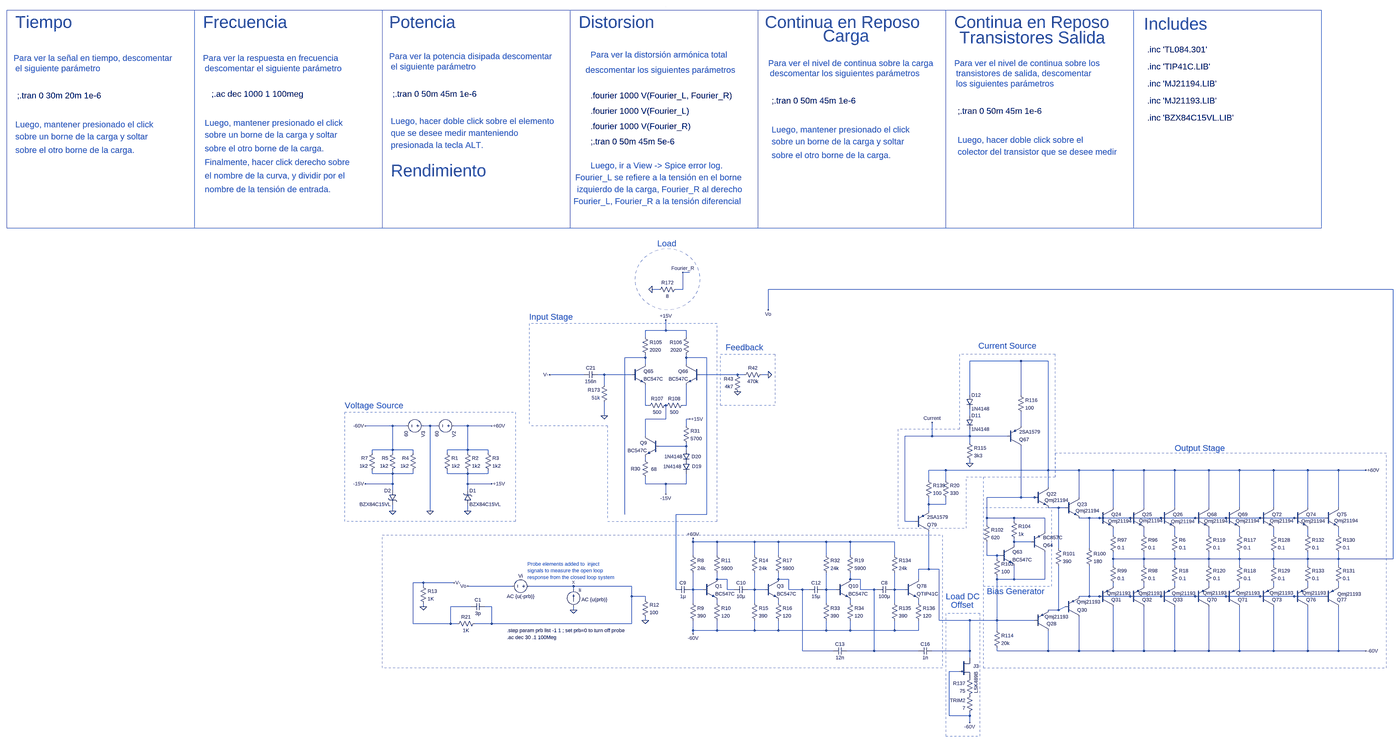
[diagram p0: schematic testV12OL.asc, whole sheet]
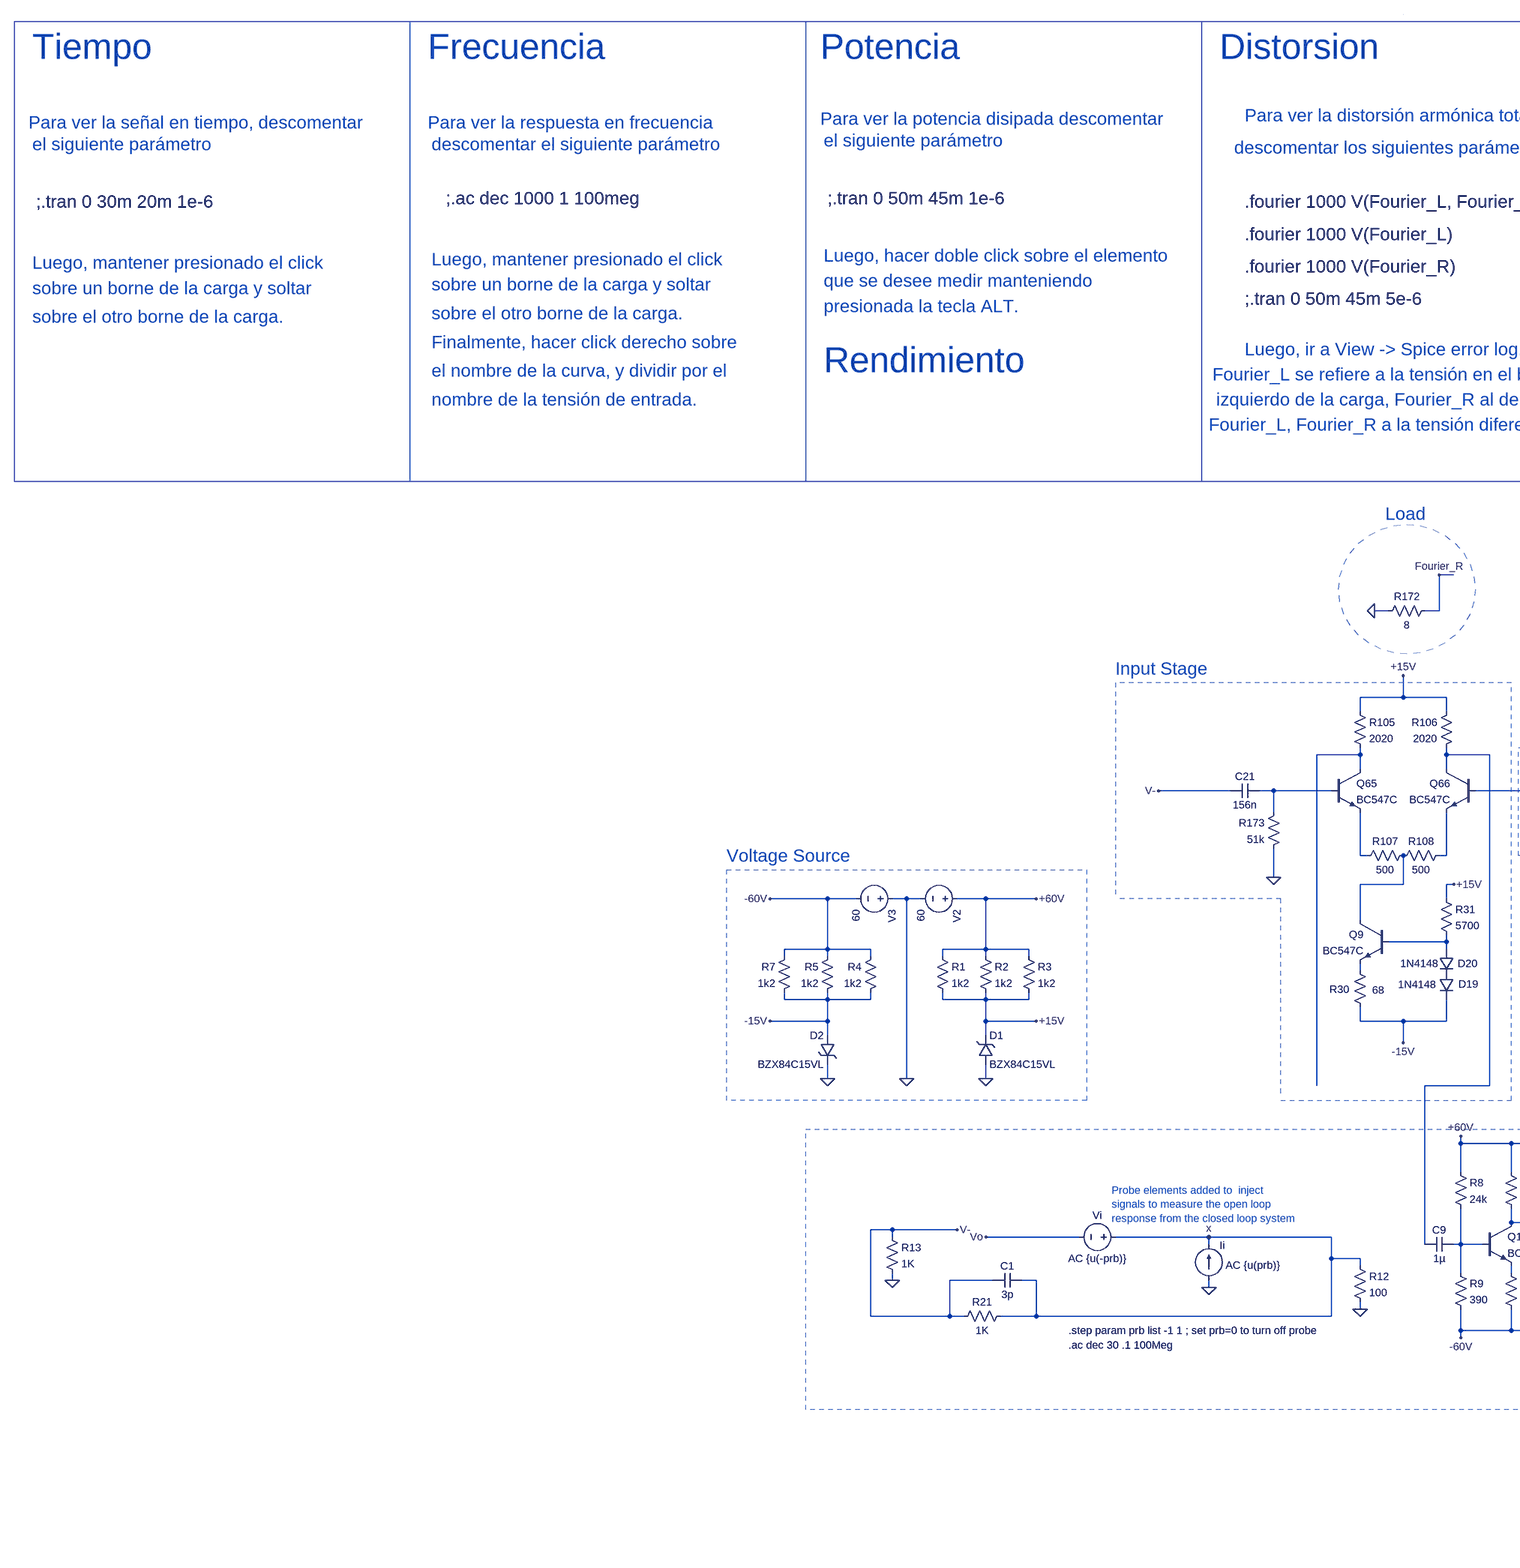
[diagram p1: schematic testV12OL.asc, part, row 1 of 1, column 1 of 2]
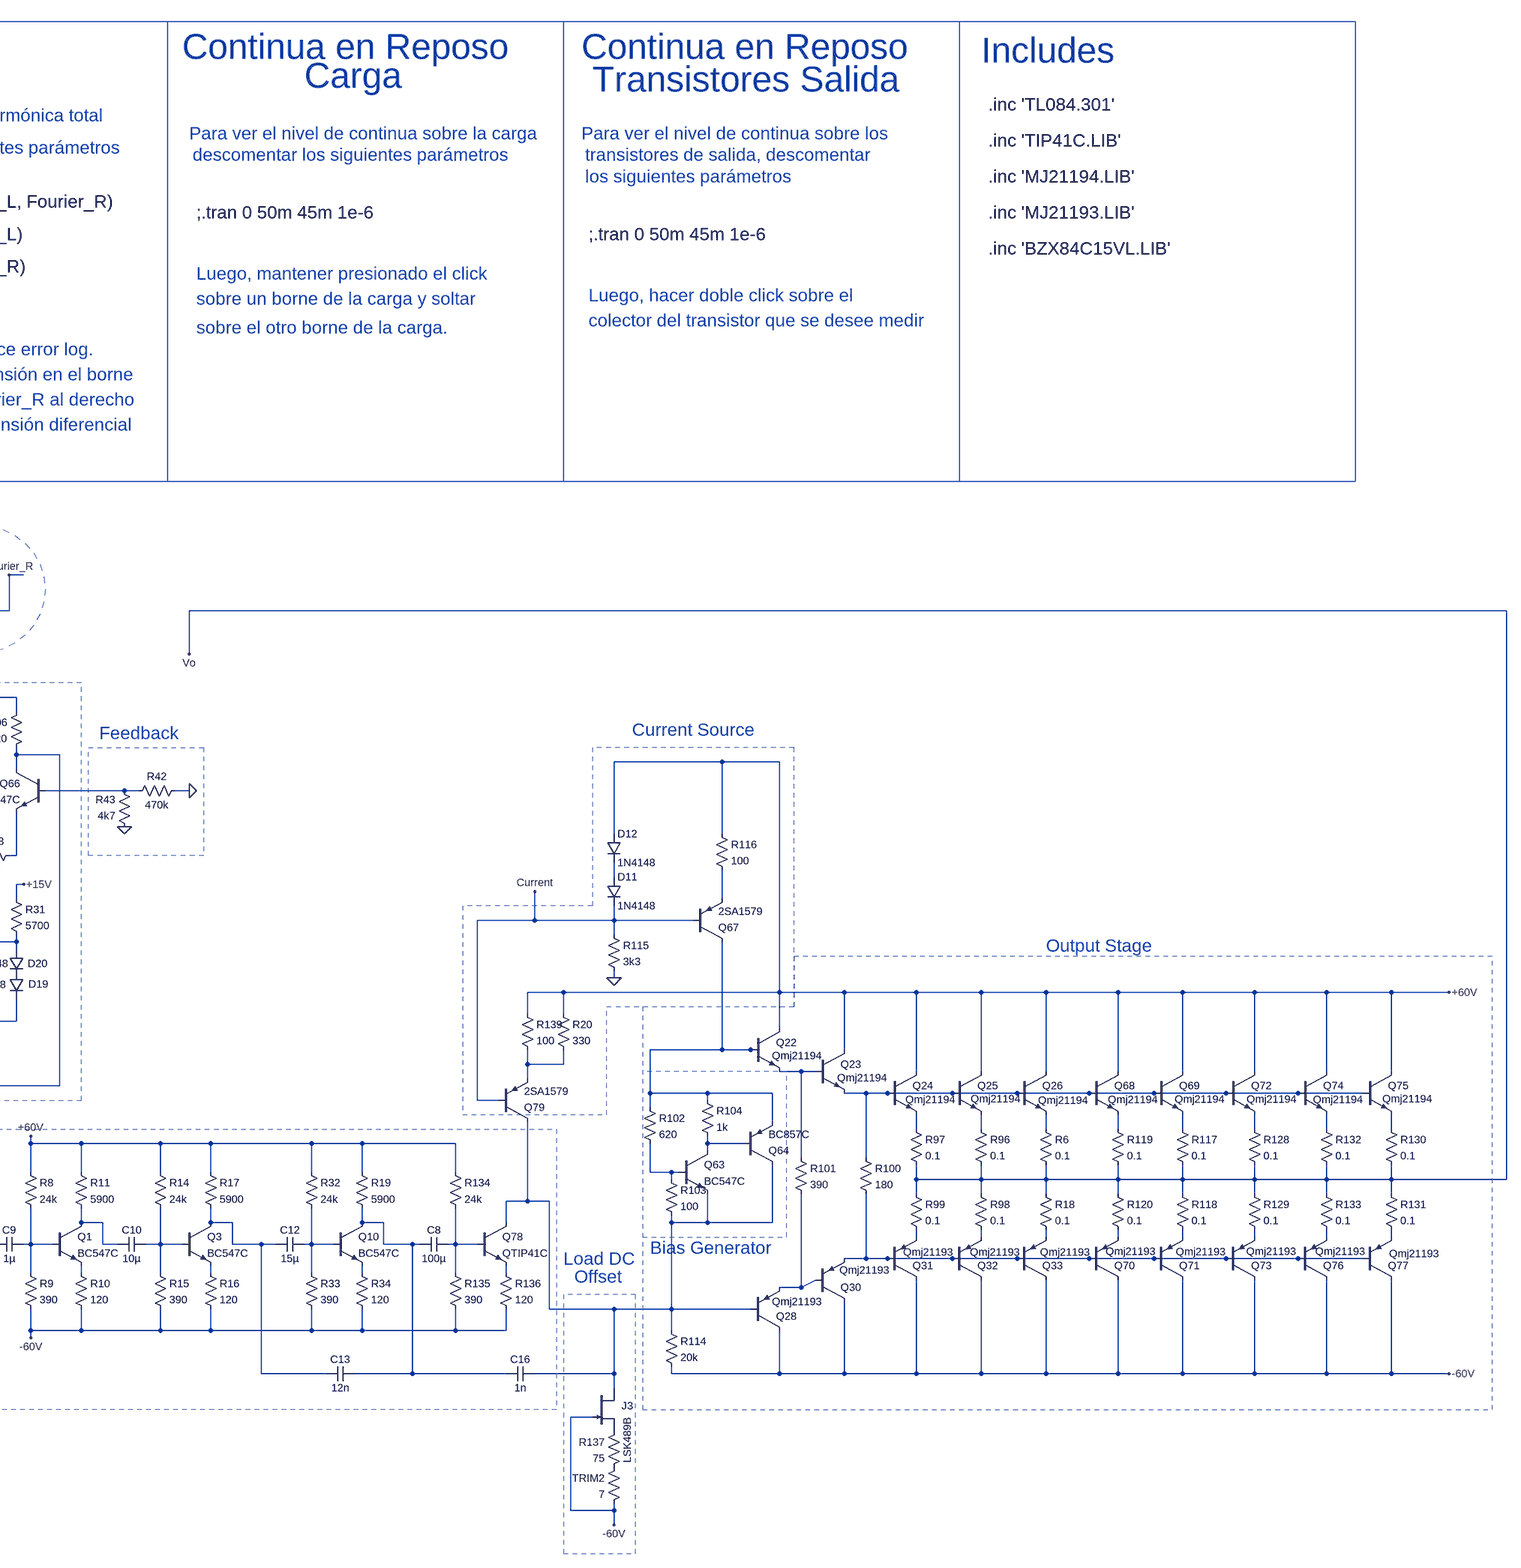
[diagram p2: schematic testV12OL.asc, part, row 1 of 1, column 2 of 2]
testV12OL.asc, the LTspice schematic file:
Version 4
SHEET 1 16980 7664
WIRE 7872 4128 7840 4128
WIRE 7728 4208 7696 4208
WIRE 7840 4208 7840 4128
WIRE 7840 4208 7808 4208
WIRE 11168 4208 8240 4208
WIRE 8240 4304 8240 4208
WIRE 7760 4400 7760 4352
WIRE 7760 4400 7664 4400
WIRE 7856 4400 7760 4400
WIRE 7664 4432 7664 4400
WIRE 7856 4432 7856 4400
WIRE 7664 4528 7664 4512
WIRE 7664 4528 7568 4528
WIRE 7856 4528 7856 4512
WIRE 7952 4528 7856 4528
WIRE 9424 4544 9184 4544
WIRE 9552 4544 9424 4544
WIRE 7664 4560 7664 4528
WIRE 7856 4560 7856 4528
WIRE 7376 4608 7216 4608
WIRE 7472 4608 7440 4608
WIRE 7600 4608 7472 4608
WIRE 8096 4608 7920 4608
WIRE 8128 4608 8096 4608
WIRE 8240 4608 8208 4608
WIRE 7472 4656 7472 4608
WIRE 9184 4704 9184 4544
WIRE 9424 4704 9424 4544
WIRE 7664 4752 7664 4656
WIRE 7680 4752 7664 4752
WIRE 7856 4752 7856 4656
WIRE 7856 4752 7840 4752
WIRE 7472 4800 7472 4736
WIRE 9184 4800 9184 4768
WIRE 7760 4816 7760 4752
WIRE 7760 4816 7664 4816
WIRE 7872 4816 7856 4816
WIRE 6480 4848 6352 4848
WIRE 6544 4848 6480 4848
WIRE 6656 4848 6624 4848
WIRE 6688 4848 6656 4848
WIRE 6832 4848 6768 4848
WIRE 6944 4848 6832 4848
WIRE 7856 4848 7856 4816
WIRE 9424 4848 9424 4784
WIRE 7664 4896 7664 4816
WIRE 9008 4896 9008 4832
WIRE 9008 4896 8880 4896
WIRE 9184 4896 9184 4864
WIRE 9184 4896 9008 4896
WIRE 9360 4896 9184 4896
WIRE 9184 4928 9184 4896
WIRE 7856 4944 7856 4928
WIRE 7856 4944 7728 4944
WIRE 6480 4960 6480 4848
WIRE 6480 4960 6384 4960
WIRE 6576 4960 6480 4960
WIRE 6832 4960 6832 4848
WIRE 6832 4960 6736 4960
WIRE 6928 4960 6832 4960
WIRE 7856 4960 7856 4944
WIRE 6384 4976 6384 4960
WIRE 6480 4976 6480 4960
WIRE 6576 4976 6576 4960
WIRE 6736 4976 6736 4960
WIRE 6832 4976 6832 4960
WIRE 6928 4976 6928 4960
WIRE 7664 5008 7664 4992
WIRE 7856 5024 7856 5008
WIRE 9184 5024 9184 5008
WIRE 9072 5056 8992 5056
WIRE 9552 5056 9552 4544
WIRE 9552 5056 9072 5056
WIRE 9696 5056 9552 5056
WIRE 9856 5056 9696 5056
WIRE 10000 5056 9856 5056
WIRE 10144 5056 10000 5056
WIRE 10304 5056 10144 5056
WIRE 10448 5056 10304 5056
WIRE 10608 5056 10448 5056
WIRE 10768 5056 10608 5056
WIRE 10912 5056 10768 5056
WIRE 11040 5056 10912 5056
WIRE 6384 5072 6384 5056
WIRE 6480 5072 6480 5056
WIRE 6480 5072 6384 5072
WIRE 6576 5072 6576 5056
WIRE 6576 5072 6480 5072
WIRE 6736 5072 6736 5056
WIRE 6832 5072 6832 5056
WIRE 6832 5072 6736 5072
WIRE 6928 5072 6928 5056
WIRE 6928 5072 6832 5072
WIRE 8992 5104 8992 5056
WIRE 9072 5104 9072 5056
WIRE 6480 5120 6480 5072
WIRE 6480 5120 6352 5120
WIRE 6832 5120 6832 5072
WIRE 6944 5120 6832 5120
WIRE 7664 5120 7664 5088
WIRE 7760 5120 7664 5120
WIRE 7856 5120 7856 5072
WIRE 7856 5120 7760 5120
WIRE 9552 5136 9552 5056
WIRE 6480 5152 6480 5120
WIRE 6832 5152 6832 5120
WIRE 7760 5168 7760 5120
WIRE 9424 5184 9424 4944
WIRE 9424 5184 9264 5184
WIRE 9488 5184 9424 5184
WIRE 9504 5184 9488 5184
WIRE 9696 5184 9696 5056
WIRE 8992 5216 8992 5184
WIRE 9072 5216 9072 5184
WIRE 9072 5216 8992 5216
WIRE 9600 5232 9552 5232
WIRE 9632 5232 9600 5232
WIRE 9856 5232 9856 5056
WIRE 10000 5232 10000 5056
WIRE 10144 5232 10144 5056
WIRE 10304 5232 10304 5056
WIRE 10448 5232 10448 5056
WIRE 10608 5232 10608 5056
WIRE 10768 5232 10768 5056
WIRE 10912 5232 10912 5056
WIRE 6480 5248 6480 5216
WIRE 6656 5248 6656 4848
WIRE 6832 5248 6832 5216
WIRE 8992 5248 8992 5216
WIRE 7568 5264 7568 4528
WIRE 7952 5264 7952 4528
WIRE 7952 5264 7808 5264
WIRE 9264 5280 9264 5184
WIRE 9392 5280 9264 5280
WIRE 9536 5280 9392 5280
WIRE 9744 5280 9696 5280
WIRE 9792 5280 9744 5280
WIRE 9936 5280 9792 5280
WIRE 10080 5280 9936 5280
WIRE 10240 5280 10080 5280
WIRE 10384 5280 10240 5280
WIRE 10544 5280 10384 5280
WIRE 10704 5280 10544 5280
WIRE 10848 5280 10704 5280
WIRE 8880 5296 8880 4896
WIRE 8928 5296 8880 5296
WIRE 9392 5296 9392 5280
WIRE 9264 5312 9264 5280
WIRE 9536 5344 9536 5280
WIRE 9856 5360 9856 5328
WIRE 10000 5360 10000 5328
WIRE 10144 5360 10144 5328
WIRE 10304 5360 10304 5328
WIRE 10448 5360 10448 5328
WIRE 10608 5360 10608 5328
WIRE 10768 5360 10768 5328
WIRE 10912 5360 10912 5328
WIRE 7888 5392 7888 5376
WIRE 8000 5392 7888 5392
WIRE 8176 5392 8000 5392
WIRE 8288 5392 8176 5392
WIRE 8512 5392 8288 5392
WIRE 8624 5392 8512 5392
WIRE 8832 5392 8624 5392
WIRE 9392 5392 9392 5376
WIRE 9472 5392 9392 5392
WIRE 9392 5408 9392 5392
WIRE 9600 5424 9600 5232
WIRE 9744 5424 9744 5280
WIRE 7888 5456 7888 5392
WIRE 8000 5456 8000 5392
WIRE 8176 5456 8176 5392
WIRE 8288 5456 8288 5392
WIRE 8512 5456 8512 5392
WIRE 8624 5456 8624 5392
WIRE 8832 5456 8832 5392
WIRE 9264 5456 9264 5392
WIRE 9312 5456 9264 5456
WIRE 9328 5456 9312 5456
WIRE 9312 5472 9312 5456
WIRE 9856 5472 9856 5440
WIRE 10000 5472 10000 5440
WIRE 10000 5472 9856 5472
WIRE 10144 5472 10144 5440
WIRE 10144 5472 10000 5472
WIRE 10304 5472 10304 5440
WIRE 10304 5472 10144 5472
WIRE 10448 5472 10448 5440
WIRE 10448 5472 10304 5472
WIRE 10608 5472 10608 5440
WIRE 10608 5472 10448 5472
WIRE 10768 5472 10768 5440
WIRE 10768 5472 10608 5472
WIRE 10912 5472 10912 5440
WIRE 10912 5472 10768 5472
WIRE 11168 5472 11168 4208
WIRE 11168 5472 10912 5472
WIRE 9856 5504 9856 5472
WIRE 10000 5504 10000 5472
WIRE 10144 5504 10144 5472
WIRE 10304 5504 10304 5472
WIRE 10448 5504 10448 5472
WIRE 10608 5504 10608 5472
WIRE 10768 5504 10768 5472
WIRE 10912 5504 10912 5472
WIRE 8992 5520 8992 5344
WIRE 8992 5520 8944 5520
WIRE 9040 5520 8992 5520
WIRE 8000 5568 8000 5536
WIRE 8048 5568 8000 5568
WIRE 8288 5568 8288 5536
WIRE 8336 5568 8288 5568
WIRE 8624 5568 8624 5536
WIRE 8672 5568 8624 5568
WIRE 8944 5568 8944 5520
WIRE 9312 5568 9312 5552
WIRE 9392 5568 9392 5504
WIRE 9392 5568 9312 5568
WIRE 9536 5568 9536 5440
WIRE 9536 5568 9392 5568
WIRE 6624 5584 6576 5584
WIRE 6768 5584 6624 5584
WIRE 6624 5600 6624 5584
WIRE 7040 5600 6832 5600
WIRE 7328 5600 7120 5600
WIRE 7600 5600 7328 5600
WIRE 9856 5600 9856 5584
WIRE 10000 5600 10000 5584
WIRE 10144 5600 10144 5584
WIRE 10304 5600 10304 5584
WIRE 10448 5600 10448 5584
WIRE 10608 5600 10608 5584
WIRE 10768 5600 10768 5584
WIRE 10912 5600 10912 5584
WIRE 7328 5616 7328 5600
WIRE 7808 5616 7808 5264
WIRE 7888 5616 7888 5536
WIRE 7888 5616 7872 5616
WIRE 7936 5616 7888 5616
WIRE 8048 5616 8048 5568
WIRE 8080 5616 8048 5616
WIRE 8176 5616 8176 5536
WIRE 8176 5616 8144 5616
WIRE 8224 5616 8176 5616
WIRE 8336 5616 8336 5568
WIRE 8400 5616 8336 5616
WIRE 8432 5616 8400 5616
WIRE 8512 5616 8512 5536
WIRE 8512 5616 8496 5616
WIRE 8560 5616 8512 5616
WIRE 8672 5616 8672 5568
WIRE 8736 5616 8672 5616
WIRE 8752 5616 8736 5616
WIRE 8832 5616 8832 5536
WIRE 8832 5616 8816 5616
WIRE 8880 5616 8832 5616
WIRE 7600 5648 7600 5600
WIRE 7664 5648 7600 5648
WIRE 9744 5648 9744 5504
WIRE 9744 5648 9696 5648
WIRE 9792 5648 9744 5648
WIRE 9936 5648 9792 5648
WIRE 10080 5648 9936 5648
WIRE 10240 5648 10080 5648
WIRE 10384 5648 10240 5648
WIRE 10544 5648 10384 5648
WIRE 10704 5648 10544 5648
WIRE 10848 5648 10704 5648
WIRE 7664 5664 7664 5648
WIRE 7888 5680 7888 5616
WIRE 8000 5680 8000 5664
WIRE 8176 5680 8176 5616
WIRE 8288 5680 8288 5664
WIRE 8512 5680 8512 5616
WIRE 8624 5680 8624 5664
WIRE 8832 5680 8832 5616
WIRE 8944 5680 8944 5664
WIRE 6624 5696 6624 5680
WIRE 6848 5696 6752 5696
WIRE 6944 5696 6912 5696
WIRE 7328 5712 7328 5696
WIRE 9600 5712 9600 5504
WIRE 9600 5712 9632 5696
WIRE 9600 5712 9552 5712
WIRE 7664 5760 7664 5744
WIRE 9040 5760 9040 5520
WIRE 9184 5760 9040 5760
WIRE 9312 5760 9312 5568
WIRE 9312 5760 9184 5760
WIRE 9488 5760 9312 5760
WIRE 6576 5776 6576 5584
WIRE 6752 5776 6752 5696
WIRE 6752 5776 6576 5776
WIRE 6784 5776 6752 5776
WIRE 6944 5776 6944 5696
WIRE 6944 5776 6864 5776
WIRE 7600 5776 7600 5648
WIRE 7600 5776 6944 5776
WIRE 7888 5808 7888 5760
WIRE 8000 5808 8000 5760
WIRE 8000 5808 7888 5808
WIRE 8176 5808 8176 5760
WIRE 8176 5808 8000 5808
WIRE 8288 5808 8288 5760
WIRE 8288 5808 8176 5808
WIRE 8512 5808 8512 5760
WIRE 8512 5808 8288 5808
WIRE 8624 5808 8624 5760
WIRE 8624 5808 8512 5808
WIRE 8832 5808 8832 5760
WIRE 8832 5808 8624 5808
WIRE 8944 5808 8944 5760
WIRE 8944 5808 8832 5808
WIRE 9312 5808 9312 5760
WIRE 7888 5824 7888 5808
WIRE 8400 5904 8400 5616
WIRE 8544 5904 8400 5904
WIRE 8736 5904 8736 5616
WIRE 8736 5904 8608 5904
WIRE 8944 5904 8736 5904
WIRE 9184 5904 9184 5760
WIRE 9184 5904 9008 5904
WIRE 9312 5904 9312 5888
WIRE 9552 5904 9552 5808
WIRE 9552 5904 9312 5904
WIRE 9696 5904 9696 5744
WIRE 9696 5904 9552 5904
WIRE 9856 5904 9856 5696
WIRE 9856 5904 9696 5904
WIRE 10000 5904 10000 5696
WIRE 10000 5904 9856 5904
WIRE 10144 5904 10144 5696
WIRE 10144 5904 10000 5904
WIRE 10304 5904 10304 5696
WIRE 10304 5904 10144 5904
WIRE 10448 5904 10448 5696
WIRE 10448 5904 10304 5904
WIRE 10608 5904 10608 5696
WIRE 10608 5904 10448 5904
WIRE 10768 5904 10768 5696
WIRE 10768 5904 10608 5904
WIRE 10912 5904 10912 5696
WIRE 10912 5904 10768 5904
WIRE 11040 5904 10912 5904
WIRE 9184 5936 9184 5904
WIRE 9136 6000 9088 6000
WIRE 9088 6208 9088 6000
WIRE 9184 6208 9184 6192
WIRE 9184 6208 9088 6208
WIRE 9184 6240 9184 6208
FLAG 6656 5248 0
FLAG 6944 4848 +60V
FLAG 6352 4848 -60V
FLAG 7760 4352 +15V
FLAG 9184 5024 0
FLAG 11040 5904 -60V
FLAG 11040 5056 +60V
FLAG 7472 4800 0
FLAG 9184 6240 -60V
FLAG 6832 5248 0
FLAG 6480 5248 0
FLAG 6944 5120 +15V
FLAG 6352 5120 -15V
FLAG 7840 4128 Fourier_R
FLAG 7760 5168 -15V
FLAG 7872 4816 +15V
FLAG 7888 5376 +60V
FLAG 7888 5824 -60V
FLAG 8096 4688 0
FLAG 9008 4832 Current
FLAG 7696 4208 0
FLAG 6624 5696 0
FLAG 7664 5760 0
FLAG 7328 5712 0
FLAG 7328 5600 x
FLAG 6768 5584 V-
FLAG 7216 4608 V-
FLAG 8240 4304 Vo
FLAG 6832 5600 Vo
FLAG 8240 4608 0
DATAFLAG 7280 4608 ""
DATAFLAG 7280 4608 ""
SYMBOL voltage 6784 4848 R90
WINDOW 123 0 0 Left 0
WINDOW 39 24 44 Left 2
SYMATTR InstName V2
SYMATTR Value 60
SYMBOL voltage 6640 4848 R90
WINDOW 123 0 0 Left 0
WINDOW 39 24 124 Left 2
SYMATTR InstName V3
SYMATTR Value 60
SYMBOL npn 9488 5136 R0
WINDOW 3 47 61 Left 2
SYMATTR Value Qmj21194
SYMATTR InstName Q22
SYMBOL npn 9632 5184 R0
WINDOW 3 48 62 Left 2
SYMATTR Value Qmj21194
SYMATTR InstName Q23
SYMBOL npn 9792 5232 R0
WINDOW 3 40 63 Left 2
SYMATTR Value Qmj21194
SYMATTR InstName Q24
SYMBOL npn 9936 5232 R0
WINDOW 3 41 61 Left 2
SYMATTR Value Qmj21194
SYMATTR InstName Q25
SYMBOL npn 10080 5232 R0
WINDOW 3 47 64 Left 2
SYMATTR Value Qmj21194
SYMATTR InstName Q26
SYMBOL pnp 9488 5808 M180
WINDOW 3 47 64 Left 2
SYMATTR Value Qmj21193
SYMATTR InstName Q28
SYMBOL pnp 9632 5744 M180
WINDOW 3 53 70 Left 2
SYMATTR Value Qmj21193
SYMATTR InstName Q30
SYMBOL pnp 9792 5696 M180
WINDOW 3 35 62 Left 2
SYMATTR Value Qmj21193
SYMATTR InstName Q31
SYMBOL pnp 9936 5696 M180
WINDOW 3 39 62 Left 2
SYMATTR Value Qmj21193
SYMATTR InstName Q32
SYMBOL pnp 10080 5696 M180
WINDOW 3 51 62 Left 2
SYMATTR Value Qmj21193
SYMATTR InstName Q33
SYMBOL res 10128 5344 R0
SYMATTR InstName R6
SYMATTR Value 0.1
SYMBOL res 10128 5488 R0
SYMATTR InstName R18
SYMATTR Value 0.1
SYMBOL res 9984 5344 R0
SYMATTR InstName R96
SYMATTR Value 0.1
SYMBOL res 9840 5344 R0
SYMATTR InstName R97
SYMATTR Value 0.1
SYMBOL res 9984 5488 R0
SYMATTR InstName R98
SYMATTR Value 0.1
SYMBOL res 9840 5488 R0
SYMATTR InstName R99
SYMATTR Value 0.1
SYMBOL res 9728 5408 R0
SYMATTR InstName R100
SYMATTR Value 180
SYMBOL res 9584 5408 R0
SYMATTR InstName R101
SYMATTR Value 390
SYMBOL npn 9328 5408 R0
SYMATTR InstName Q63
SYMATTR Value BC547C
SYMBOL res 9248 5296 R0
SYMATTR InstName R102
SYMATTR Value 620
SYMBOL res 9296 5456 R0
SYMATTR InstName R103
SYMATTR Value 100
SYMBOL res 9376 5280 R0
SYMATTR InstName R104
SYMATTR Value 1k
SYMBOL pnp 9472 5440 M180
SYMATTR InstName Q64
SYMATTR Value BC857C
SYMBOL npn 7600 4560 R0
SYMATTR InstName Q65
SYMATTR Value BC547C
SYMBOL npn 7920 4560 M0
SYMATTR InstName Q66
SYMATTR Value BC547C
SYMBOL res 7648 4416 R0
SYMATTR InstName R105
SYMATTR Value 2020
SYMBOL res 7872 4416 M0
SYMATTR InstName R106
SYMATTR Value 2020
SYMBOL res 7776 4736 R90
WINDOW 0 0 56 VBottom 2
WINDOW 3 32 56 VTop 2
SYMATTR InstName R107
SYMATTR Value 500
SYMBOL res 7856 4736 R90
WINDOW 0 0 56 VBottom 2
WINDOW 3 32 56 VTop 2
SYMATTR InstName R108
SYMATTR Value 500
SYMBOL res 9296 5792 R0
SYMATTR InstName R114
SYMATTR Value 20k
SYMBOL pnp 9360 4944 M180
SYMATTR InstName Q67
SYMATTR Value 2SA1579
SYMBOL res 9168 4912 R0
SYMATTR InstName R115
SYMATTR Value 3k3
SYMBOL diode 9168 4800 R0
SYMATTR InstName D11
SYMATTR Value 1N4148
SYMBOL diode 9168 4704 R0
SYMATTR InstName D12
SYMATTR Value 1N4148
SYMBOL res 9408 4688 R0
SYMATTR InstName R116
SYMATTR Value 100
SYMBOL npn 10240 5232 R0
WINDOW 3 42 63 Left 2
SYMATTR Value Qmj21194
SYMATTR InstName Q68
SYMBOL npn 10384 5232 R0
WINDOW 3 46 62 Left 2
SYMATTR Value Qmj21194
SYMATTR InstName Q69
SYMBOL pnp 10240 5696 M180
WINDOW 3 37 64 Left 2
SYMATTR Value Qmj21193
SYMATTR InstName Q70
SYMBOL pnp 10384 5696 M180
WINDOW 3 49 63 Left 2
SYMATTR Value Qmj21193
SYMATTR InstName Q71
SYMBOL res 10432 5344 R0
SYMATTR InstName R117
SYMATTR Value 0.1
SYMBOL res 10432 5488 R0
SYMATTR InstName R118
SYMATTR Value 0.1
SYMBOL res 10288 5344 R0
SYMATTR InstName R119
SYMATTR Value 0.1
SYMBOL res 10288 5488 R0
SYMATTR InstName R120
SYMATTR Value 0.1
SYMBOL npn 10544 5232 R0
WINDOW 3 46 62 Left 2
SYMATTR Value Qmj21194
SYMATTR InstName Q72
SYMBOL pnp 10544 5696 M180
WINDOW 3 45 64 Left 2
SYMATTR Value Qmj21193
SYMATTR InstName Q73
SYMBOL res 10592 5344 R0
SYMATTR InstName R128
SYMATTR Value 0.1
SYMBOL res 10592 5488 R0
SYMATTR InstName R129
SYMATTR Value 0.1
SYMBOL npn 10704 5232 R0
WINDOW 3 34 63 Left 2
SYMATTR Value Qmj21194
SYMATTR InstName Q74
SYMBOL npn 10848 5232 R0
WINDOW 3 44 61 Left 2
SYMATTR Value Qmj21194
SYMATTR InstName Q75
SYMBOL pnp 10704 5696 M180
WINDOW 3 39 64 Left 2
SYMATTR Value Qmj21193
SYMATTR InstName Q76
SYMBOL pnp 10848 5696 M180
WINDOW 3 59 59 Left 2
SYMATTR Value Qmj21193
SYMATTR InstName Q77
SYMBOL res 10896 5344 R0
SYMATTR InstName R130
SYMATTR Value 0.1
SYMBOL res 10896 5488 R0
SYMATTR InstName R131
SYMATTR Value 0.1
SYMBOL res 10752 5344 R0
SYMATTR InstName R132
SYMATTR Value 0.1
SYMBOL res 10752 5488 R0
SYMATTR InstName R133
SYMATTR Value 0.1
SYMBOL res 8816 5440 R0
SYMATTR InstName R134
SYMATTR Value 24k
SYMBOL res 8816 5664 R0
SYMATTR InstName R135
SYMATTR Value 390
SYMBOL npn 8880 5568 R0
SYMATTR InstName Q78
SYMATTR Value QTIP41C
SYMBOL res 8928 5664 R0
SYMATTR InstName R136
SYMATTR Value 120
SYMBOL njf 9136 5936 R0
WINDOW 0 65 39 Left 2
WINDOW 3 78 65 VRight 2
SYMATTR InstName J3
SYMATTR Value LSK489B
SYMBOL res 9200 6016 M0
SYMATTR InstName R137
SYMATTR Value 75
SYMBOL pnp 8928 5344 M180
SYMATTR InstName Q79
SYMATTR Value 2SA1579
SYMBOL res 8976 5088 R0
SYMATTR InstName R139
SYMATTR Value 100
SYMBOL cap 9008 5888 R90
WINDOW 0 0 32 VBottom 2
WINDOW 3 32 32 VTop 2
SYMATTR InstName C16
SYMATTR Value 1n
SYMATTR SpiceLine Rser=0.1
SYMBOL cap 7440 4592 R90
WINDOW 0 0 32 VBottom 2
WINDOW 3 32 32 VTop 2
SYMATTR InstName C21
SYMATTR Value 156n
SYMATTR SpiceLine Rser=0.1
SYMBOL res 7488 4640 M0
SYMATTR InstName R173
SYMATTR Value 51k
SYMBOL res 7824 4192 R90
WINDOW 0 0 56 VBottom 2
WINDOW 3 32 56 VTop 2
SYMATTR InstName R172
SYMATTR Value 8
SYMBOL res 6720 4960 R0
SYMATTR InstName R1
SYMATTR Value 1k2
SYMBOL res 6816 4960 R0
SYMATTR InstName R2
SYMATTR Value 1k2
SYMBOL res 6912 4960 R0
SYMATTR InstName R3
SYMATTR Value 1k2
SYMBOL res 6592 4960 M0
SYMATTR InstName R4
SYMATTR Value 1k2
SYMBOL res 6496 4960 M0
SYMATTR InstName R5
SYMATTR Value 1k2
SYMBOL res 6400 4960 M0
SYMATTR InstName R7
SYMATTR Value 1k2
SYMBOL zener 6816 5216 M180
WINDOW 0 24 64 Left 2
WINDOW 3 24 0 Left 2
SYMATTR InstName D1
SYMATTR Value BZX84C15VL
SYMBOL zener 6496 5152 M0
SYMATTR InstName D2
SYMATTR Value BZX84C15VL
SYMBOL diode 7872 5008 M0
WINDOW 0 -55 30 Left 2
WINDOW 3 39 31 Left 2
SYMATTR InstName D19
SYMATTR Value 1N4148
SYMBOL diode 7872 4960 M0
WINDOW 0 -53 32 Left 2
WINDOW 3 34 32 Left 2
SYMATTR InstName D20
SYMATTR Value 1N4148
SYMBOL npn 7728 4896 M0
SYMATTR InstName Q9
SYMATTR Value BC547C
SYMBOL res 7648 4992 R0
WINDOW 0 -52 58 Left 2
WINDOW 3 43 59 Left 2
SYMATTR InstName R30
SYMATTR Value 68
SYMBOL res 7840 4832 R0
SYMATTR InstName R31
SYMATTR Value 5700
SYMBOL res 7872 5440 R0
SYMATTR InstName R8
SYMATTR Value 24k
SYMBOL res 7872 5664 R0
SYMATTR InstName R9
SYMATTR Value 390
SYMBOL npn 7936 5568 R0
SYMATTR InstName Q1
SYMATTR Value BC547C
SYMBOL res 7984 5664 R0
SYMATTR InstName R10
SYMATTR Value 120
SYMBOL res 8160 5440 R0
SYMATTR InstName R14
SYMATTR Value 24k
SYMBOL res 8160 5664 R0
SYMATTR InstName R15
SYMATTR Value 390
SYMBOL npn 8224 5568 R0
SYMATTR InstName Q3
SYMATTR Value BC547C
SYMBOL res 8272 5664 R0
SYMATTR InstName R16
SYMATTR Value 120
SYMBOL res 8496 5440 R0
SYMATTR InstName R32
SYMATTR Value 24k
SYMBOL res 8496 5664 R0
SYMATTR InstName R33
SYMATTR Value 390
SYMBOL npn 8560 5568 R0
SYMATTR InstName Q10
SYMATTR Value BC547C
SYMBOL res 8608 5664 R0
SYMATTR InstName R34
SYMATTR Value 120
SYMBOL res 8224 4592 R90
WINDOW 0 0 56 VBottom 2
WINDOW 3 32 56 VTop 2
SYMATTR InstName R42
SYMATTR Value 470k
SYMBOL res 8112 4704 R180
WINDOW 0 36 76 Left 2
WINDOW 3 36 40 Left 2
SYMATTR InstName R43
SYMATTR Value 4k7
SYMBOL res 7984 5440 R0
SYMATTR InstName R11
SYMATTR Value 5900
SYMBOL res 8272 5440 R0
SYMATTR InstName R17
SYMATTR Value 5900
SYMBOL res 8608 5440 R0
SYMATTR InstName R19
SYMATTR Value 5900
SYMBOL cap 8544 5888 M90
WINDOW 0 0 32 VBottom 2
WINDOW 3 32 32 VTop 2
SYMATTR InstName C13
SYMATTR Value 12n
SYMATTR SpiceLine Rser=0.1
SYMBOL cap 8752 5600 M90
WINDOW 0 0 32 VBottom 2
WINDOW 3 32 32 VTop 2
SYMATTR InstName C8
SYMATTR Value 100µ
SYMATTR SpiceLine Rser=0.1
SYMBOL cap 7872 5600 R90
WINDOW 0 0 32 VBottom 2
WINDOW 3 32 32 VTop 2
SYMATTR InstName C9
SYMATTR Value 1µ
SYMBOL cap 8144 5600 R90
WINDOW 0 0 32 VBottom 2
WINDOW 3 32 32 VTop 2
SYMATTR InstName C10
SYMATTR Value 10µ
SYMBOL cap 8496 5600 R90
WINDOW 0 0 32 VBottom 2
WINDOW 3 32 32 VTop 2
SYMATTR InstName C12
SYMATTR Value 15µ
SYMBOL res 9056 5088 R0
SYMATTR InstName R20
SYMATTR Value 330
SYMBOL res 9200 6096 M0
SYMATTR InstName TRIM2
SYMATTR Value 7
SYMBOL res 7648 5648 R0
SYMATTR InstName R12
SYMATTR Value 100
SYMBOL res 6608 5584 R0
SYMATTR InstName R13
SYMATTR Value 1K
SYMBOL res 6880 5760 R90
WINDOW 0 0 56 VBottom 2
WINDOW 3 32 56 VTop 2
SYMATTR InstName R21
SYMATTR Value 1K
SYMBOL cap 6912 5680 R90
WINDOW 0 0 32 VBottom 2
WINDOW 3 32 32 VTop 2
SYMATTR InstName C1
SYMATTR Value 3p
SYMBOL current 7328 5696 M180
WINDOW 0 24 77 Left 2
WINDOW 3 24 0 Left 2
WINDOW 123 37 33 Left 2
WINDOW 39 0 0 Left 2
SYMATTR InstName Ii
SYMATTR Value ""
SYMATTR Value2 AC {u(prb)}
SYMBOL voltage 7136 5600 M270
WINDOW 0 32 56 VTop 2
WINDOW 3 -32 56 VBottom 2
WINDOW 123 -32 56 VBottom 2
WINDOW 39 -32 56 VBottom 2
SYMATTR InstName Vi
SYMATTR Value ""
SYMATTR Value2 AC {u(-prb)}
TEXT 10016 2552 Left 4 !.inc 'TL084.301'
TEXT 10016 2632 Left 4 !.inc 'TIP41C.LIB'
TEXT 10016 2712 Left 4 !.inc 'MJ21194.LIB'
TEXT 10016 2792 Left 4 !.inc 'MJ21193.LIB'
TEXT 10016 2872 Left 4 !.inc 'BZX84C15VL.LIB'
TEXT 6480 2760 Left 4 !;.tran 0 50m 45m 1e-6
TEXT 5632 2760 Left 4 !;.ac dec 1000 1 100meg
TEXT 7408 2768 Left 4 !.fourier 1000 V(Fourier_L, Fourier_R)
TEXT 7408 2840 Left 4 !.fourier 1000 V(Fourier_L)
TEXT 7408 2912 Left 4 !.fourier 1000 V(Fourier_R)
TEXT 6256 4752 Left 4 ;Voltage Source
TEXT 7120 4336 Left 4 ;Input Stage
TEXT 8040 4480 Left 4 ;Feedback
TEXT 10144 4952 Left 4 ;Output Stage
TEXT 7720 3992 Left 4 ;Load
TEXT 9072 5648 Left 4 ;Load DC
TEXT 9224 4472 Left 4 ;Current Source
TEXT 9264 5624 Left 4 ;Bias Generator
TEXT 4696 2424 Left 6 ;Tiempo
TEXT 9096 5688 Left 4 ;Offset
TEXT 5592 2424 Left 6 ;Frecuencia
TEXT 6464 2424 Left 6 ;Potencia
TEXT 7352 2424 Left 6 ;Distorsion
TEXT 8224 2424 Left 6 ;Continua en Reposo
TEXT 10000 2432 Left 6 ;Includes
TEXT 9112 2424 Left 6 ;Continua en Reposo
TEXT 8496 2488 Left 6 ;Carga
TEXT 9136 2496 Left 6 ;Transistores Salida
TEXT 7408 2576 Left 4 ;Para ver la distorsión armónica total
TEXT 7384 2648 Left 4 ;descomentar los siguientes parámetros
TEXT 7408 3096 Left 4 ;Luego, ir a View -> Spice error log.
TEXT 7336 3152 Left 4 ;Fourier_L se refiere a la tensión en el borne
TEXT 7344 3208 Left 4 ;izquierdo de la carga, Fourier_R al derecho
TEXT 7328 3264 Left 4 ;Fourier_L, Fourier_R a la tensión diferencial
TEXT 6464 2584 Left 4 ;Para ver la potencia disipada descomentar
TEXT 6472 2632 Left 4 ;el siguiente parámetro
TEXT 7408 2984 Left 4 !;.tran 0 50m 45m 5e-6
TEXT 6472 2888 Left 4 ;Luego, hacer doble click sobre el elemento
TEXT 6472 2944 Left 4 ;que se desee medir manteniendo
TEXT 5592 2592 Left 4 ;Para ver la respuesta en frecuencia
TEXT 5600 2640 Left 4 ;descomentar el siguiente parámetro
TEXT 5600 2896 Left 4 ;Luego, mantener presionado el click
TEXT 5600 2952 Left 4 ;sobre un borne de la carga y soltar
TEXT 5600 3016 Left 4 ;sobre el otro borne de la carga.
TEXT 5600 3080 Left 4 ;Finalmente, hacer click derecho sobre
TEXT 5600 3144 Left 4 ;el nombre de la curva, y dividir por el
TEXT 5600 3208 Left 4 ;nombre de la tensión de entrada.
TEXT 8256 2792 Left 4 !;.tran 0 50m 45m 1e-6
TEXT 8240 2616 Left 4 ;Para ver el nivel de continua sobre la carga
TEXT 8248 2664 Left 4 ;descomentar los siguientes parámetros
TEXT 8256 2928 Left 4 ;Luego, mantener presionado el click
TEXT 8256 2984 Left 4 ;sobre un borne de la carga y soltar
TEXT 8256 3048 Left 4 ;sobre el otro borne de la carga.
TEXT 9128 2840 Left 4 !;.tran 0 50m 45m 1e-6
TEXT 9112 2616 Left 4 ;Para ver el nivel de continua sobre los
TEXT 9120 2664 Left 4 ;transistores de salida, descomentar
TEXT 9128 2976 Left 4 ;Luego, hacer doble click sobre el
TEXT 9128 3032 Left 4 ;colector del transistor que se desee medir
TEXT 9120 2712 Left 4 ;los siguientes parámetros
TEXT 4704 2768 Left 4 !;.tran 0 30m 20m 1e-6
TEXT 4688 2592 Left 4 ;Para ver la señal en tiempo, descomentar
TEXT 4696 2640 Left 4 ;el siguiente parámetro
TEXT 4696 2904 Left 4 ;Luego, mantener presionado el click
TEXT 4696 2960 Left 4 ;sobre un borne de la carga y soltar
TEXT 4696 3024 Left 4 ;sobre el otro borne de la carga.
TEXT 6472 3120 Left 6 ;Rendimiento
TEXT 6472 3000 Left 4 ;presionada la tecla ALT.
TEXT 7016 5840 Left 2 !.ac dec 30 .1 100Meg
TEXT 7016 5808 Left 2 !.step param prb list -1 1 ; set prb=0 to turn off probe
TEXT 7112 5496 Left 2 ;Probe elements added to  inject\nsignals to measure the open loop\nresponse from the closed loop system
LINE Normal 7488 4848 7120 4848 2
LINE Normal 7488 5280 7488 4848 2
LINE Normal 7120 4368 7120 4848 2
LINE Normal 8000 4368 7120 4368 2
LINE Normal 8000 5296 8000 4368 2
LINE Normal 7488 5296 8000 5296 2
LINE Normal 8016 4752 8016 4512 2
LINE Normal 8272 4752 8016 4752 2
LINE Normal 8272 4512 8272 4752 2
LINE Normal 8016 4512 8272 4512 2
LINE Normal 11136 5984 11136 4976 2
LINE Normal 9248 5984 11136 5984 2
LINE Normal 8272 4752 8016 4752 2
LINE Normal 9584 4976 9584 5088 2
LINE Normal 11136 4976 9584 4976 2
LINE Normal 11136 5984 11136 4976 2
LINE Normal 9248 5984 11136 5984 2
LINE Normal 9248 5088 9248 5984 2
LINE Normal 8848 4864 8848 5328 2
LINE Normal 9136 4864 8848 4864 2
LINE Normal 9136 4512 9136 4864 2
LINE Normal 9584 4512 9136 4512 2
LINE Normal 9584 5088 9584 4512 2
LINE Normal 9168 5088 9584 5088 2
LINE Normal 9168 5328 9168 5088 2
LINE Normal 8848 5328 9168 5328 2
LINE Normal 9568 5232 9248 5232 2
LINE Normal 9568 5600 9568 5232 2
LINE Normal 9248 5600 9568 5600 2
LINE Normal 7808 2368 7808 2368 2
LINE Normal 5552 3120 5552 3184
LINE Normal 6432 3120 6432 3184
LINE Normal 7760 2352 7760 2352
LINE Normal 5552 2368 5552 3920
LINE Normal 6432 2368 6432 3920
LINE Normal 7312 2368 7312 3920
LINE Normal 8192 2368 8192 3920
LINE Normal 9072 2368 9072 3920
LINE Normal 9952 2368 9952 3920
RECTANGLE Normal 7056 5296 6256 4784 2
RECTANGLE Normal 9056 5984 6432 5360 2
RECTANGLE Normal 9232 5728 9072 6304 2
RECTANGLE Normal 10832 3920 4656 2368
CIRCLE Normal 7920 4304 7616 4016 2

The netlist it stands for:
* testV12OL.asc
V2 +60V 0 60
V3 0 -60V 60
Q22 +60V N013 N015 0 Qmj21194
Q23 +60V N015 N016 0 Qmj21194
Q24 +60V N016 N017 0 Qmj21194
Q25 +60V N016 N018 0 Qmj21194
Q26 +60V N016 N019 0 Qmj21194
Q28 -60V N027 N048 0 Qmj21193
Q30 -60V N048 N043 0 Qmj21193
Q31 -60V N043 N031 0 Qmj21193
Q32 -60V N043 N032 0 Qmj21193
Q33 -60V N043 N033 0 Qmj21193
R6 N019 Vo 0.1
R18 Vo N033 0.1
R96 N018 Vo 0.1
R97 N017 Vo 0.1
R98 Vo N032 0.1
R99 Vo N031 0.1
R100 N016 N043 180
R101 N015 N048 390
Q63 N025 N026 N027 0 BC547C
R102 N013 N026 620
R103 N026 N027 100
R104 N013 N025 1k
Q64 N027 N025 N013 0 BC857C
Q65 N001 N003 N005 0 BC547C
Q66 N002 N004 N006 0 BC547C
R105 +15V N001 2020
R106 +15V N002 2020
R107 N008 N005 500
R108 N006 N008 500
R114 N027 -60V 20k
Q67 N013 Current N009 0 2SA1579
R115 Current 0 3k3
D11 N007 Current 1N4148
D12 +60V N007 1N4148
R116 +60V N009 100
Q68 +60V N016 N020 0 Qmj21194
Q69 +60V N016 N021 0 Qmj21194
Q70 -60V N043 N034 0 Qmj21193
Q71 -60V N043 N035 0 Qmj21193
R117 N021 Vo 0.1
R118 Vo N035 0.1
R119 N020 Vo 0.1
R120 Vo N034 0.1
Q72 +60V N016 N022 0 Qmj21194
Q73 -60V N043 N036 0 Qmj21193
R128 N022 Vo 0.1
R129 Vo N036 0.1
Q74 +60V N016 N023 0 Qmj21194
Q75 +60V N016 N024 0 Qmj21194
Q76 -60V N043 N037 0 Qmj21193
Q77 -60V N043 N038 0 Qmj21193
R130 N024 Vo 0.1
R131 Vo N038 0.1
R132 N023 Vo 0.1
R133 Vo N037 0.1
R134 +60V N042 24k
R135 N042 -60V 390
Q78 N027 N042 N047 0 QTIP41C
R136 N047 -60V 120
J3 N027 -60V P001 LSK489B
R137 P001 P002 75
Q79 N027 Current N014 0 2SA1579
R139 +60V N014 100
C16 N027 N030 1n Rser=0.1
C21 N003 V- 156n Rser=0.1
R173 N003 0 51k
R172 Fourier_R 0 8
R1 +60V +15V 1k2
R2 +60V +15V 1k2
R3 +60V +15V 1k2
R4 -60V -15V 1k2
R5 -60V -15V 1k2
R7 -60V -15V 1k2
D1 0 +15V BZX84C15VL
D2 -15V 0 BZX84C15VL
D19 N012 -15V 1N4148
D20 N010 N012 1N4148
Q9 N008 N010 N011 0 BC547C
R30 N011 -15V 68
R31 +15V N010 5700
R8 +60V N039 24k
R9 N039 -60V 390
Q1 N028 N039 N044 0 BC547C
R10 N044 -60V 120
R14 +60V N040 24k
R15 N040 -60V 390
Q3 N029 N040 N045 0 BC547C
R16 N045 -60V 120
R32 +60V N041 24k
R33 N041 -60V 390
Q10 N030 N041 N046 0 BC547C
R34 N046 -60V 120
R42 0 N004 470k
R43 0 N004 4k7
R11 +60V N028 5900
R17 +60V N029 5900
R19 +60V N030 5900
C13 N029 N030 12n Rser=0.1
C8 N030 N042 100µ Rser=0.1
C9 N039 N002 1µ
C10 N040 N028 10µ
C12 N041 N029 15µ
R20 +60V N014 330
R§TRIM2 P002 -60V 7
R12 x 0 100
R13 V- 0 1K
R21 x V- 1K
C1 x V- 3p
Ii 0 x AC {u(prb)}
Vi x Vo AC {u(-prb)}
.model D D
.lib standard.dio
.model NPN NPN
.model PNP PNP
.lib standard.bjt
.model NJF NJF
.model PJF PJF
.lib standard.jft
.inc 'TL084.301'
.inc 'TIP41C.LIB'
.inc 'MJ21194.LIB'
.inc 'MJ21193.LIB'
.inc 'BZX84C15VL.LIB'
;.tran 0 50m 45m 1e-6
;.ac dec 1000 1 100meg
.fourier 1000 V(Fourier_L, Fourier_R)
.fourier 1000 V(Fourier_L)
.fourier 1000 V(Fourier_R)
* Voltage Source
* Input Stage
* Feedback
* Output Stage
* Load
* Load DC
* Current Source
* Bias Generator
* Tiempo
* Offset
* Frecuencia
* Potencia
* Distorsion
* Continua en Reposo
* Includes
* Continua en Reposo
* Carga
* Transistores Salida
* Para ver la distorsión armónica total
* descomentar los siguientes parámetros
* Luego, ir a View -> Spice error log.
* Fourier_L se refiere a la tensión en el borne
* izquierdo de la carga, Fourier_R al derecho
* Fourier_L, Fourier_R a la tensión diferencial
* Para ver la potencia disipada descomentar
* el siguiente parámetro
;.tran 0 50m 45m 5e-6
* Luego, hacer doble click sobre el elemento
* que se desee medir manteniendo
* Para ver la respuesta en frecuencia
* descomentar el siguiente parámetro
* Luego, mantener presionado el click
* sobre un borne de la carga y soltar
* sobre el otro borne de la carga.
* Finalmente, hacer click derecho sobre
* el nombre de la curva, y dividir por el
* nombre de la tensión de entrada.
;.tran 0 50m 45m 1e-6
* Para ver el nivel de continua sobre la carga
* descomentar los siguientes parámetros
* Luego, mantener presionado el click
* sobre un borne de la carga y soltar
* sobre el otro borne de la carga.
;.tran 0 50m 45m 1e-6
* Para ver el nivel de continua sobre los
* transistores de salida, descomentar
* Luego, hacer doble click sobre el
* colector del transistor que se desee medir
* los siguientes parámetros
;.tran 0 30m 20m 1e-6
* Para ver la señal en tiempo, descomentar
* el siguiente parámetro
* Luego, mantener presionado el click
* sobre un borne de la carga y soltar
* sobre el otro borne de la carga.
* Rendimiento
* presionada la tecla ALT.
.ac dec 30 .1 100Meg
.step param prb list -1 1 ; set prb=0 to turn off probe
* Probe elements added to  inject
* signals to measure the open loop
* response from the closed loop system
.backanno
.end